# Altium schematic sheet Radar_Analog.SchDoc
size A; SheetNumber: 2; SheetTotal: 4
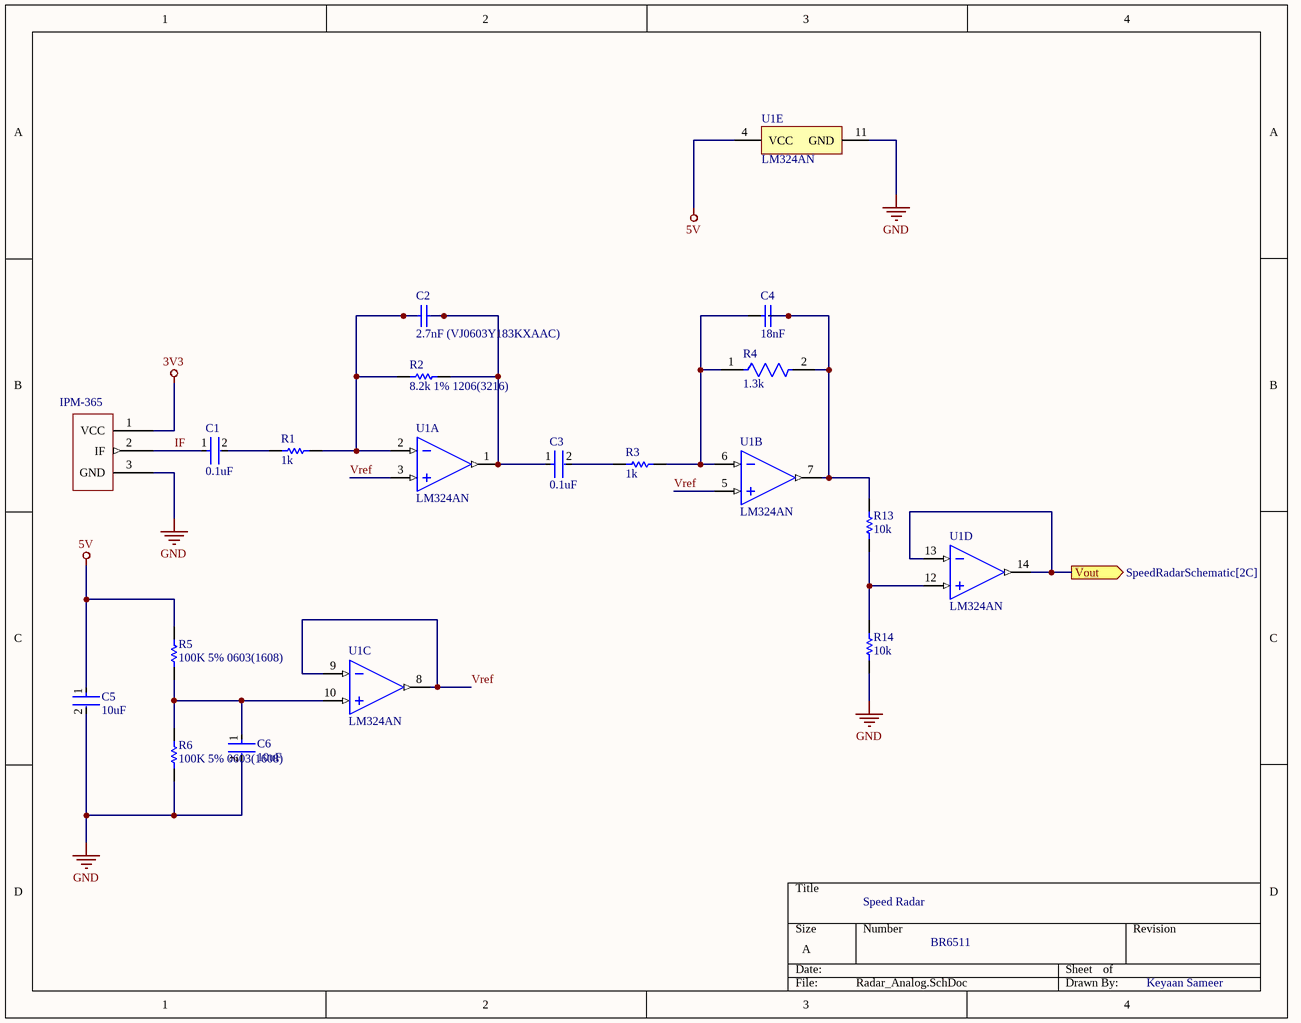
[diagram p0: Radar_Analog.SchDoc]

## Parts
C1  value 0.1uF  [FP-GCD21B-0_15-IPC_A]  (hidden comment: GCD21BR71H104KA01L)
C2  2.7nF (VJ0603Y183KXAAC)  [CAPC1608X92X38ML15T08]
C3  value 0.1uF  [FP-GCD21B-0_15-IPC_A]  (hidden comment: GCD21BR71H104KA01L)
C4  18nF  [CAPC1608X92X38ML15T08]
C5  10uF  [FP-C0805C106K8RACAUTO-MFG]
C6  10uF  [FP-C0805C106K8RACAUTO-MFG]
IPM-365  Component_1  [PCBComponent_1]  (value not drawn)
R1  value 1k  [RESC0805(2012)_L]  (hidden comment: Resistor 1K +/-5% 0805 125 mW)
R2  8.2k 1% 1206(3216)  [RESC1206(3216)_M]
R3  value 1k  [RESC0805(2012)_L]  (hidden comment: Resistor 1K +/-5% 0805 125 mW)
R4  1.3k  [FP-TFCR0603-IPC_B]
R5  100K 5% 0603(1608)  [RESC0603(1608)_N]
R6  100K 5% 0603(1608)  [RESC0603(1608)_N]
R13  value 10k  [RESC2013X50X35ML15T15]  (hidden comment: Resistor 10k +/-1% 0805 125 mW)
R14  value 10k  [RESC2013X50X35ML15T15]  (hidden comment: Resistor 10k +/-1% 0805 125 mW)
U1  LM324AN  [TI-N0014A]  (parts A,B,C,D,E of 5)

## Ports
Vout (out, see SpeedRadarSchematic[2C])

## Nets
3V3: IPM-365.1(VCC)
5V: C5.1 R5.2 U1.4(VCC)
GND: C5.2 C6.2 IPM-365.3(GND) R6.1 R14.1 U1.11(GND)
IF: C1.1 IPM-365.2(IF)
Vout: U1.13(4IN-) U1.14(4OUT) ; port Vout
Vref: U1.3(1IN+) U1.5(2IN+) U1.8(3OUT) U1.9(3IN-)
NetC1_2: C1.2 R1.1
NetC2_1: C2.1 R1.2 R2.1 U1.2(1IN-)
NetC2_2: C2.2 C3.1 R2.2 U1.1(1OUT)
NetC3_2: C3.2 R3.1
NetC4_1: C4.1 R3.2 R4.1 U1.6(2IN-)
NetC4_2: C4.2 R4.2 R13.2 U1.7(2OUT)
NetC6_1: C6.1 R5.1 R6.2 U1.10(3IN+)
NetR13_1: R13.1 R14.2 U1.12(4IN+)

## Notes on the sheet
- Speed Radar
- BR6511
- Keyaan Sameer

## Library data of the parts
C1 C3 = CMP-001-00087-1: Ceramic Capacitor, Multilayer, Ceramic, 50V, 10% +Tol, 10% -Tol, X7R, 15% TC, 0.1uF, Surface Mount, 0805; Case/Package: 0805; Mounting Technology: Surface Mount; Min Operating Temperature: -55°C; Capacitor Type: Ceramic; Pins: 2; RoHS Compliant: Yes; Max Operating Temperature: 125°C
  C3: ComponentLink1Description: New link; ComponentLink1URL: *; ComponentLink2Description: New link 1; ComponentLink2URL: *; Parameter 1: *
C2 = CMP-2006-01326-1: Manufacturer: Vitramon; Part Number: VJ0603Y183KXAAC
C4 = CMP-1035-02398-2: Manufacturer: Vitramon; Part Number: VJ0603Y183JXXAC
C5 C6 = CMP-03020-034662-1: CAP CER 10UF 10V X7R 0805; Tolerance: 10%; Case/Package: 0805; Ratings: AEC-Q200; Packaging: Tape and Reel; Voltage Rating: 10V; Max Operating Temperature: 125°C; Min Operating Temperature: -55°C; Case Code (Metric): 2012; Case Code (Imperial): 0805; Mount: Surface Mount; RoHS Compliant: Yes; Capacitance: 10uF
R1 R3 = CMP-009-00118-4: Chip Resistor, 1 kOhms, +/-5%, 125 mW, -55 to 155 degC, 0805; Tolerance: 5%; Power: 125mW; Max Operating Temperature: 155°C; Case/Package: 0805; Min Operating Temperature: -55°C; Pins: 2
R2 = CMP-1014-00613-1: 8K2 0.25W 1% 1206 (3216 Metric)  SMD; Case-EIA: 1206; Value: 8200.00 Ohm; Case-Metric: 3216; Tolerance: 1 %; Technology: SMT; Power: 0.25 W
R4 = CMP-250906-279364-1: RES Thin Film,  1.3kΩ, 0.1%, 0.1W, 25ppm/°C, 0603
R5 R6 = CMP-1012-00122-1: 100K 0.1W 5% 0603 (1608 Metric)  SMD; Case-EIA: 0603; Value: 100000.00 Ohm; Case-Metric: 1608; Tolerance: 5 %; Power: 0.1 W; Technology: SMT
R13 R14 = CMP-009-00018-6: Chip Resistor, 10 KOhm, +/- 1%, 125 mW, -55 to 155 degC, 0805 (2012 Metric); Voltage Rating: 150V; Power: 125mW; Pins: 2; Case/Package: 0805; Mounting Technology: SM; RoHS Compliant: True; Min Operating Temperature: -55°C; Max Operating Temperature: 155°C; Tolerance: 1%
U1 = CMP-014-00016-2: Quadruple Operational Amplifier, 1.2 MHz, 0 to 70 degC, 14-Pin PDIP (N), Pb-Free (RoHS), Tube; Manufacturer: Texas Instruments (TI); Max Dual Supply Voltage: 16V; Nominal Dual Supply Voltage: 12V; Nominal Voltage Gain: 100dB; Min Supply Voltage: 1.5V; Unity Gain Bandwidth Product: 1.2MHz; Output Current: 30mA; Nominal Supply Current: 3mA; RoHS Compliant: True; Package Reference: N-14; Min Operating Temperature: 0°C; Case/Package: DIP; Mounting Technology: TH; Package Description: 14-Pin Double In-line Package, Body 19.305 x 6.35 mm, Pitch 2.54 mm; Nominal Supply Voltage: 12V; Package URL: http://www.ti.com/lit/ml/mpdi002c/mpdi002c.pdf; Package Quantity: 25; Datasheet Version: SLOS066W, 03/2015; Manufacturer URL: http://www.ti.com/; Datasheet URL: http://www.ti.com/lit/ds/symlink/lm324a.pdf; Min Dual Supply Voltage: 1.5V; Max Supply Voltage: 16V; Pins: 14; Max Operating Temperature: 70°C